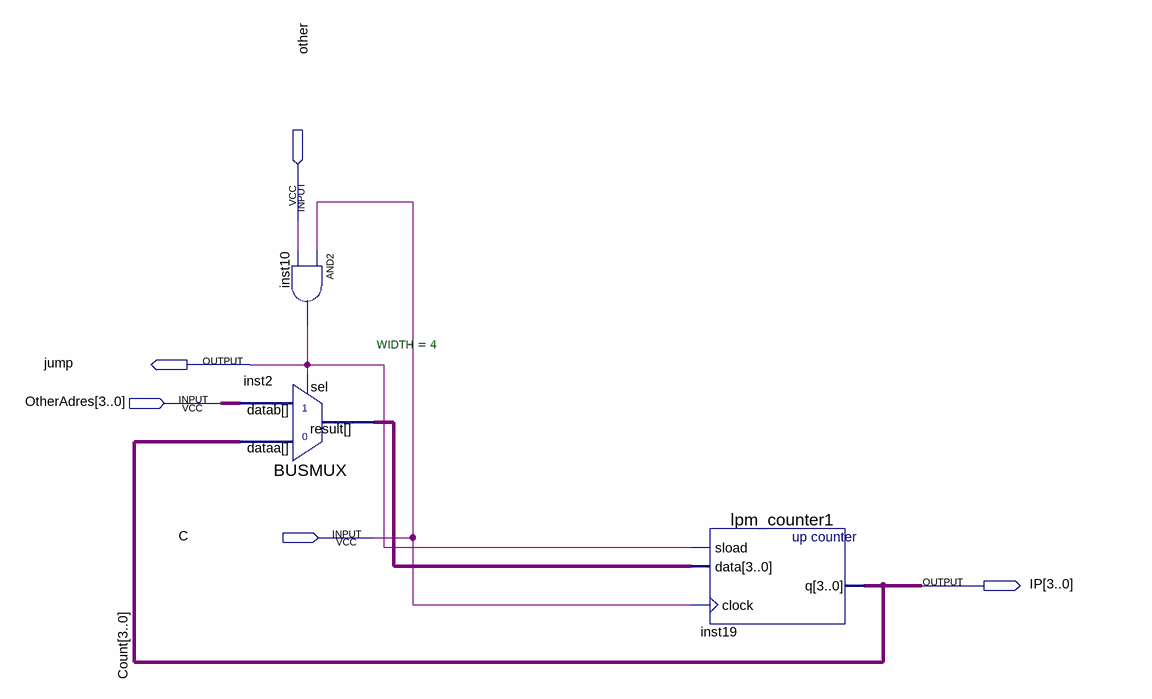
[diagram p0: schematic sheet]
// Quartus schematic IP.bdf as structural Verilog: 3 symbols, 5 pins
module IP (
  input  other,
  input  [3:0] OtherAdres,
  input  C,
  output jump,
  output [3:0] IP
);

  wire [3:0] inst2_result;

  and inst10 (jump, C, other);
  BUSMUX #(.WIDTH(4)) inst2 (.datab(OtherAdres), .sel(jump), .dataa(IP), .result(inst2_result));
  lpm_counter1 inst19 (.sload(jump), .data(inst2_result), .clock(C), .q(IP));

  // Other names for the same wires on the sheet: Count[3:0] = IP
endmodule
